# Altium schematic sheet IF_SEL.SchDoc
size A4 portrait; CompanyName: FairWaves LLC; DrawnBy: Andrey Sviyazov; DocumentNumber: 4; Revision: 1; SheetNumber: 4; SheetTotal: 5
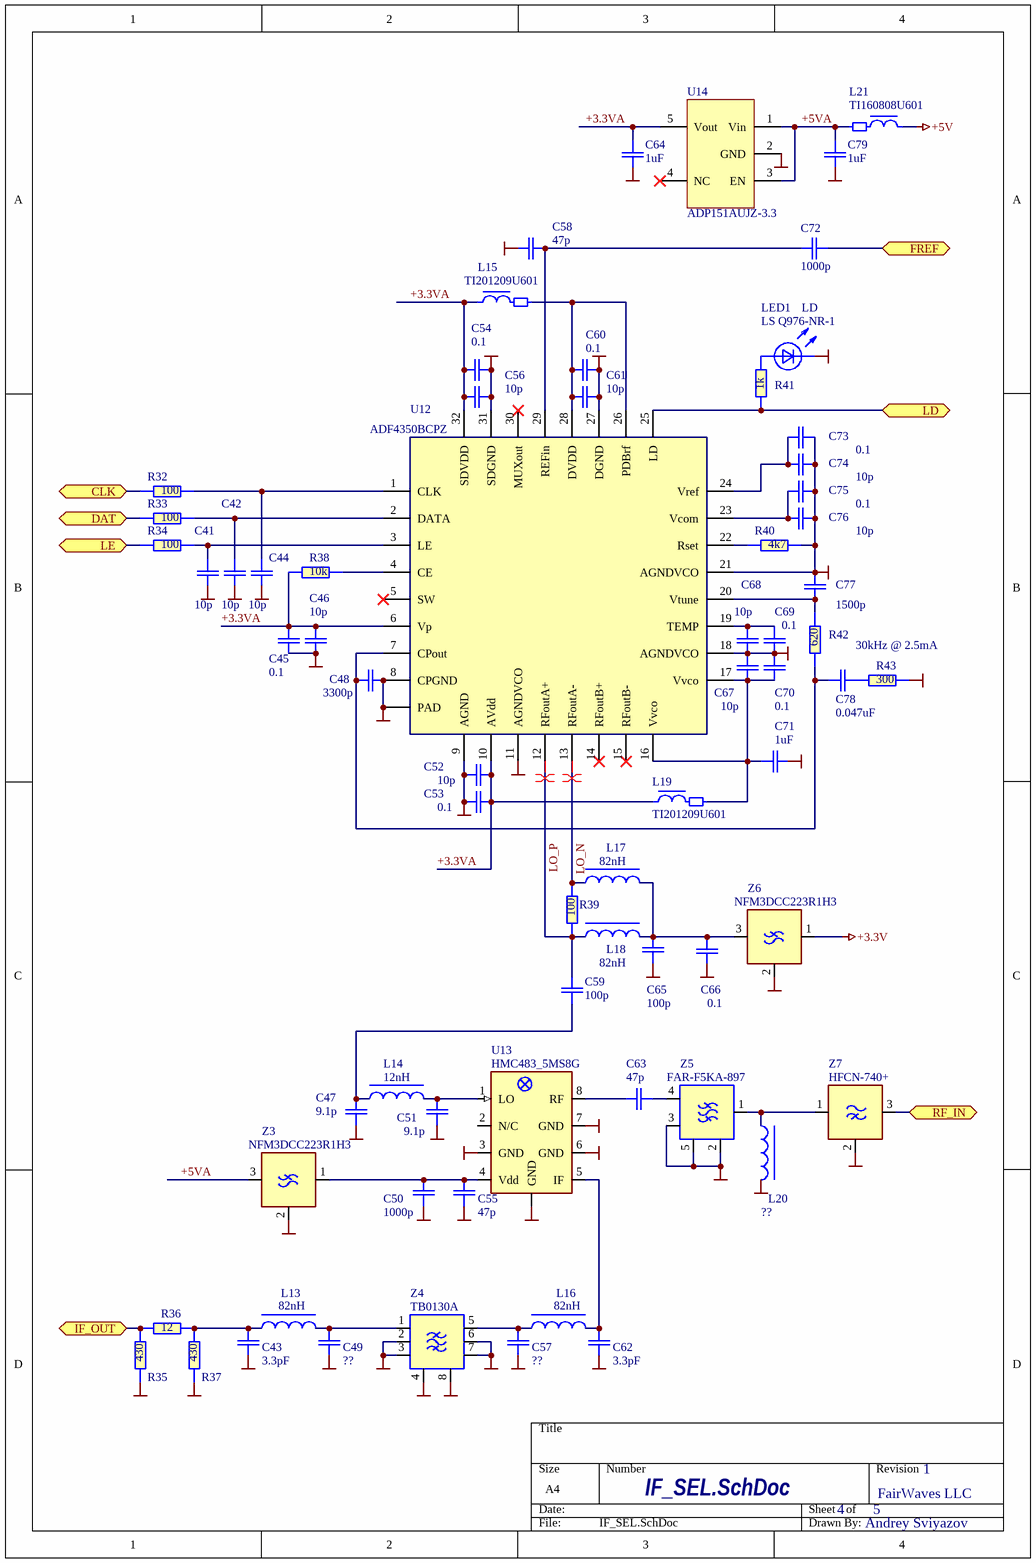
[diagram p0: IF_SEL.SchDoc]

## Parts
C41  10p  [C0603-Phillips]
C42  10p  [C0603-Phillips]
C43  3.3pF  [C0603-Phillips]
C44  10p  [C0603-Phillips]
C45  0.1  [C0603-Phillips]
C46  10p  [C0603-Phillips]
C47  9.1p  [C0603-Phillips]
C48  3300p  [C0603-Phillips]
C49  ??  [C0603-Phillips]
C50  1000p  [C0603-Phillips]
C51  9.1p  [C0603-Phillips]
C52  10p  [C0603-Phillips]
C53  0.1  [C0603-Phillips]
C54  0.1  [C0603-Phillips]
C55  47p  [C0603-Phillips]
C56  10p  [C0603-Phillips]
C57  ??  [C0603-Phillips]
C58  47p  [C0603-Phillips]
C59  100p  [C0603-Phillips]
C60  0.1  [C0603-Phillips]
C61  10p  [C0603-Phillips]
C62  3.3pF  [C0603-Phillips]
C63  47p  [C0603-Phillips]
C64  1uF  [C0603-Phillips]
C65  100p  [C0603-Phillips]
C66  0.1  [C0603-Phillips]
C67  10p  [C0603-Phillips]
C68  10p  [C0603-Phillips]
C69  0.1  [C0603-Phillips]
C70  0.1  [C0603-Phillips]
C71  1uF  [C0603-Phillips]
C72  1000p  [C0603-Phillips]
C73  0.1  [C0603-Phillips]
C74  10p  [C0603-Phillips]
C75  0.1  [C0603-Phillips]
C76  10p  [C0603-Phillips]
C77  1500p  [C0603-Phillips]
C78  0.047uF  [C0603-Phillips]
C79  1uF  [C0603-Phillips]
L13  82nH  [TF160808-Phillips]
L14  12nH  [TF160808-Phillips]
L15  TI201209U601  [TI2012-Phillips]
L16  82nH  [TF160808-Phillips]
L17  82nH  [TF160808-Phillips]
L18  82nH  [TF160808-Phillips]
L19  TI201209U601  [TI2012-Phillips]
L20  ??  [TF160808-Phillips]
L21  TI160808U601  [Ti160808-Phillips]
LED1  LS Q976-NR-1  Misc: LD  [LED-0603y]
R32  100  [R0603-PHILLIPS]
R33  100  [R0603-PHILLIPS]
R34  100  [R0603-PHILLIPS]
R35  430  [R0603-PHILLIPS]
R36  12  [R0603-PHILLIPS]
R37  430  [R0603-PHILLIPS]
R38  10k  [R0603-PHILLIPS]
R39  100  [R0603-PHILLIPS]
R40  4k7  [R0603-PHILLIPS]
R41  1k  [R0603-PHILLIPS]
R42  620  [R0603-PHILLIPS]
R43  300  [R0603-PHILLIPS]
U12  ADF4350BCPZ  [CP-32-2]
U13  HMC483_5MS8G  [MS8G]
U14  ADP151AUJZ-3.3  [SOT-23-5[3.1x1.8/0.95]]
Z3  NFM3DCC223R1H3  [NFM3DC]
Z4  TB0130A  [DCC8_5x5]
Z5  FAR-F5KA-897  [SAW-1.4x1x0.5mm]
Z6  NFM3DCC223R1H3  [NFM3DC]
Z7  HFCN-740+  [LFCN-HFCN]

## Ports
CLK, DAT, FREF, IF_OUT, LD, LE, RF_IN

## Nets
+3.3V: Z6.1
+5V: L21.1
GND: C41.1 C42.1 C43.1 C44.1 C45.1 C46.1 C47.2 C48.1 C49.1 C50.2 C51.2 C52.2 C53.2 C54.2 C55.2 C56.2 C57.1 C58.1 C60.2 C61.2 C62.1 C64.1 C65.2 C66.1 C67.2 C68.1 C69.1 C70.2 C71.1 C73.2 C74.2 C75.2 C76.2 C77.2 C79.1 L20.2 LED1.1(K) R35.1 R37.1 R40.2 R43.2 U12.0(PAD) U12.8(CPGND) U12.9(AGND) U12.11(AGNDVCO) U12.18(AGNDVCO) U12.21(AGNDVCO) U12.27(DGND) U12.31(SDGND) U13.0(GND) U13.3(GND) U13.6(GND) U13.7(GND) U14.2(GND) Z3.2 Z4.2(In2) Z4.3(In3) Z4.4(Gnd) Z4.6(Out2) Z4.7(Out3) Z4.8(Gnd) Z5.2(GND) Z5.3(~{Out}) Z5.5(GND) Z6.2 Z7.2
+3.3VA: C45.2 C46.2 C52.1 C53.1 C54.1 C56.1 C64.2 L15.1 L19.1 R38.1 U12.6(Vp) U12.10(AVdd) U12.32(SDVDD) U14.5(Vout)
+5VA: C79.2 L21.2 U14.1(Vin) U14.3(EN) Z3.3
CLK: R32.1 ; port CLK
DAT: R33.1 ; port DAT
FREF: C72.2 ; port FREF
IF_OUT: R35.2 R36.1 ; port IF_OUT
LD: R41.1 U12.25(LD) ; port LD
LE: R34.1 ; port LE
LO_N: L17.1 R39.2 U12.13(RFoutA-)
LO_P: C59.1 L18.1 R39.1 U12.12(RFoutA+)
RF_IN: Z7.3 ; port RF_IN
NetC41_2: C41.2 R34.2 U12.3(LE)
NetC42_2: C42.2 R33.2 U12.2(DATA)
NetC43_2: C43.2 L13.1 R36.2 R37.2
NetC44_2: C44.2 R32.2 U12.1(CLK)
NetC47_1: C47.1 C59.2 L14.2
NetC48_2: C48.2 C78.2 R42.1 U12.7(CPout)
NetC49_2: C49.2 L13.2 Z4.1(IN1)
NetC50_1: C50.1 C55.1 U13.4(Vdd) Z3.1
NetC51_1: C51.1 L14.1 U13.1(LO)
NetC57_2: C57.2 L16.1 Z4.5(Out1)
NetC58_2: C58.2 C72.1 U12.29(REFin)
NetC60_1: C60.1 C61.1 L15.2 U12.26(PDBrf) U12.28(DVDD)
NetC62_2: C62.2 L16.2 U13.5(IF)
NetC63_1: C63.1 U13.8(RF)
NetC63_2: C63.2 Z5.4(Out)
NetC65_1: C65.1 C66.2 L17.2 L18.2 Z6.3
NetC67_1: C67.1 C70.1 C71.2 L19.2 U12.16(Vvco) U12.17(Vvco)
NetC68_2: C68.2 C69.2 U12.19(TEMP)
NetC73_1: C73.1 C74.1 U12.24(Vref)
NetC75_1: C75.1 C76.1 U12.23(Vcom)
NetC77_1: C77.1 R42.2 U12.20(Vtune)
NetC78_1: C78.1 R43.1
NetL20_1: L20.1 Z5.1(IN) Z7.1
NetLED1_2: LED1.2(A) R41.2
NetR38_2: R38.2 U12.4(CE)
NetR40_1: R40.1 U12.22(Rset)

Not connected (* = marked no-connect by the designer): U12 5(SW)* 14(RFoutB+)* 15(RFoutB-)* 30(MUXout)*; U13 2(N/C); U14 4(NC)*

## Layout directives
differential pair: LO_N, LO_P

## Notes on the sheet
- 30kHz @ 2.5mA

## Library data of the parts
C41-C44 C46-C52 C55-C59 C61-C63 C65 C67 C68 C72 C74 C76 C77 = C0603: Capacitor; Manufacturer: MURATA; Tolerance: 20%; Name: SMD0603; U/P/TKE: NP0
  C41 C42 C44 C46 C52 C56 C61 C67 C68 C74 C76: Value: 10p
  C43 C62: Value: 3.3pF
  C47 C51: Value: 9.1p
  C48: Value: 3300p
  C49 C57: Value: ??
  C50 C72: Value: 1000p
  C55 C58 C63: Value: 47p
  C59 C65: Value: 100p
  C77: Value: 1500p
C45 C53 C54 C60 C64 C66 C69-C71 C73 C75 C79 = C0603: Capacitor; Manufacturer: MURATA; Tolerance: 20%; Name: SMD0603; U/P/TKE: Y5V
  C45 C53 C54 C60 C66 C69 C70 C73 C75: Value: 0.1
  C64 C71 C79: Value: 1uF
C78 = C0603: Capacitor; Manufacturer: MURATA; Tolerance: 20%; Name: SMD0603; U/P/TKE: X5R; Value: 0.047uF
L13 L14 L16-L18 L20 = TF160808: Coil; Manufacturer: SMD; Name: TF160808
  L13 L16-L18: Value: 82nH
  L14: Value: 12nH
  L20: Value: ??
L15 L19 = TI2012_1: Choke; Manufacturer: MURATA; Name: TI201209U601; Value: *
L21 = TI160808: Choke; Manufacturer: MURATA; Name: TI160808U601; Value: *
LED1 = LED0603: LED SMD; Manufacturer: OSRAM Opto Semi; Name: LS Q976-NR-1
R32-R43 = R0603: Resistor; Manufacturer: YAGEO; Tolerance: 5%; Name: SMD0603; U/P/TKE: 0.1W
  R32-R34 R39: Value: 100
  R35 R37: Value: 430
  R36: Value: 12
  R38: Value: 10k
  R40: Value: 4k7
  R41: Value: 1k
  R42: Value: 620
  R43: Value: 300
U12 = ADF4350BCPZ: IC; Manufacturer: Analog Devices; Misc: RF Synthesizer with VCO; Swap: No; Name: ADF4350BCPZ
U13 = HMC483_5MS8G: IC; Manufacturer: Hittite; Swap: No; Misc: High IP3 Mixer with  LO Amp; Name: HMC483_5MS8G
U14 = ADP151AUJZ: IC; Manufacturer: AD; Name: ADP151AUJZ-3.3
Z3 Z6 = NFM3DC: EMI_FILTER; Manufacturer: Murata; Value: 22nF; PDF: D:\Proj\Components\Murata\EMI Suppression Filters.pdf; Name: NFM3DCC223R1H3; Misc: EMI_FILTER
Z4 = SAW 5x5-8 SMD: SAW filter; Manufacturer: Tai-SAW; Misc: Low-Loss IF Filter for Mobile Communication; Name: TB0130A
Z5 = SAW 1.4x1.0-5 SMD: SAW Filter; Manufacturer: Taiyo Yuden; Misc: Low-Loss Filter for Mobile Communication; Name: FAR-F5KA-897
Z7 = HFCN-2700: High pass filter; Manufacturer: MiniCircuits; Misc: HPF-740МГц; Name: HFCN-740+; Value: HFCN-740+